# Altium schematic sheet LDO.SchDoc
size A4
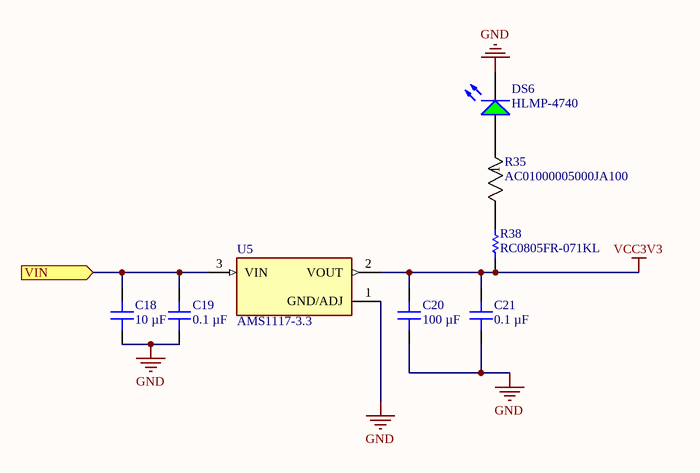
[diagram p0: LDO.SchDoc]

## Parts
C18  10 µF  [CAP 0805_2012]
C19  0.1 µF  [CAP 0805_2012]
C20  100 µF  [CAP 0805_2012]
C21  0.1 µF  [CAP 0805_2012]
DS6  HLMP-4740  [AVAG-HLMP-4740]
R35  AC01000005000JA100  [RES_AC01_VIS]
R38  RC0805FR-071KL  [RESC2013X60X35ML10T20]
U5  AMS1117-3.3  [SOT229P700X180-4N]

## Ports
VIN (in)

## Nets
GND: C18.1 C19.1 C20.1 C21.1 DS6.2(K) U5.1(GND/ADJ)
VCC3V3: C20.2 C21.2 R38.2 U5.2(VOUT)
VIN: C18.2 C19.2 U5.3(VIN) ; port VIN
NetDS6_1: DS6.1(A) R35.1
NetR35_2: R35.2 R38.1

## Library data of the parts
C18 = C2012X6S1C106K125AC: CAP CER 10UF 16V X6S 0805; manufacturer: TDK Corporation; Tolerance: ±10%; Part Number: C2012X6S1C106K125AC; Value: 10 µF; Applications: General Purpose; Capacitance: 10 µF; componentlink1description: Datasheet; componentlink1url: https://product.tdk.com/info/en/catalog/datasheets/mlcc_commercial_general_en.pdf?ref_disty=digikey; componentlink2description: DigiKey Link; componentlink2url: https://www.digikey.com/en/products/detail/tdk-corporation/C2012X6S1C106K125AC/2733046; Device Package: 0805 (2012 Metric); Features: Low ESL; lastupdated: 2023-10-02 7:13:05 PM; Lifecycle Status: Active; Minimum Order: 1; Mounting Type: Surface Mount, MLCC; Operating Temperature: -55°C ~ 105°C; Package / Case: 0805 (2012 Metric); packaging: TapeAndReel; partid: 2995; Part Status: Active; price: 0.07; series: C; Size / Dimension: 0.079" L x 0.049" W (2.00mm x 1.25mm); Supplier 1: DigiKey; Supplier Part Number 1: 445-7611-1-ND; Temperature Coefficient: X6S; Thickness (Max): 0.057" (1.45mm); Voltage - Rated: 16V
C19 C21 = CC0805MRX7R9BB104: CAP CER 0.1UF 50V X7R 0805; manufacturer: Yageo; Tolerance: ±20%; Part Number: CC0805MRX7R9BB104; Value: 0.1 µF; Applications: General Purpose; Capacitance: 0.1 µF; componentlink1description: Datasheet; componentlink1url: https://www.yageo.com/upload/media/product/productsearch/datasheet/mlcc/UPY-GPHC_X7R_6.3V-to-50V_18.pdf; componentlink2description: DigiKey Link; componentlink2url: https://www.digikey.com/en/products/detail/yageo/CC0805MRX7R9BB104/5884281; Device Package: 0805 (2012 Metric); lastupdated: 2023-10-02 7:13:07 PM; Lifecycle Status: Active; Minimum Order: 1; Mounting Type: Surface Mount, MLCC; Operating Temperature: -55°C ~ 125°C; Package / Case: 0805 (2012 Metric); packaging: TapeAndReel; partid: 2475; Part Status: Active; price: 0.01; series: CC; Size / Dimension: 0.079" L x 0.049" W (2.00mm x 1.25mm); Supplier 1: DigiKey; Supplier Part Number 1: 311-4351-1-ND; Temperature Coefficient: X7R; Thickness (Max): 0.037" (0.95mm); Voltage - Rated: 50V
C20 = PMK212BBJ107MG-T: CAP CER 100UF 2.5V X5R 0805; manufacturer: Taiyo Yuden; Tolerance: ±20%; Part Number: PMK212BBJ107MG-T; Value: 100 µF; Applications: SMPS Filtering; Capacitance: 100 µF; componentlink1description: Datasheet; componentlink1url: https://ds.yuden.co.jp/TYCOMPAS/ut/detail?pn=PMK212BBJ107MG-T  &u=M; componentlink2description: DigiKey Link; componentlink2url: https://www.digikey.com/en/products/detail/taiyo-yuden/PMK212BBJ107MG-T/4950524; Device Package: 0805 (2012 Metric); lastupdated: 2023-10-02 7:12:56 PM; Lifecycle Status: Active; Minimum Order: 1; Mounting Type: Surface Mount, MLCC; Operating Temperature: -55°C ~ 85°C; Package / Case: 0805 (2012 Metric); packaging: TapeAndReel; partid: 7580; Part Status: Active; price: 0.48; series: M; Size / Dimension: 0.079" L x 0.049" W (2.00mm x 1.25mm); Supplier 1: DigiKey; Supplier Part Number 1: 587-3978-1-ND; Temperature Coefficient: X5R; Thickness (Max): 0.053" (1.35mm); Voltage - Rated: 2.5V
DS6 = CMP-2000-06413-1: T-1 3/4 (5 mm) Low Current LED Lamp, Green, 1.9 V, -20 to 100 degC, 2-Pin THD, RoHS, Bulk; Manufacturer: AvagoTechnologies; Type: Uni-Color; Peak Wavelength: 565nm; Rad Hard: No; Viewing Angle: 50°; Dominant Wavelength/Color Temperature: 569nm; Number of LEDs: 1; Lens Appearance: ColoredDiffused; Lens Shape Type: Circular; Mounting Orientation: TopMount; Intensity: 2.3mcd; Datasheet Version: 07/2014; Category: LEDs; Datasheet URL: http://docs.avagotech.com/docs/AV02-1557EN; Packaging: Bulk; Pin Count: 2; Mounting Technology: ThroughHole; Package Reference: HLMP-4740; Mounting: ThroughHole; Manufacturer URL: http://www.avagotech.com/; Color: Green; Package: 2T-13/4; Package Description: 2-Pin Through Hole Device, Dia 5.845 mm, Pitch 2.54 mm
R35 = CMP-00030-39746512-1: AC01000005000JA100 Res Wirewound 500 Ohm 5% 1W 100ppm/°C to 180ppm/°C Conformal AXL Thru-Hole Ammo Pack; Voltage Rating (DC): 22V; Lead Diameter: 800µm; Resistance: 500Ω; Weight: 519.986953mg; Number of Pins: 2; Min Operating Temperature: -40°C; Case/Package: Axial; Schedule B: 8533210080, 8533210080; Features: Flame Retardant Coating; Power Rating: 1W; Max Power Dissipation: 1W; Packaging: Tape & Box (TB); RoHS: Compliant; REACH SVHC: Unknown; NexarPartId: 39746512; Temperature Coefficient: 180ppm/°C; Diameter: 4.3mm; Contact Plating: Tin; Radiation Hardening: No; Max Operating Temperature: 275°C; Length: 11mm; Tolerance: 5%; Composition: Wirewound; Number of Terminations: 2; Termination: Axial; Voltage Rating: 22V
R38 = CMP-2100-03671-1: Chip Resistor, 1 KOhm, +/- 1%, 125 mW, -55 to 155 degC, 0805 (2012 Metric), RoHS, Tape and Reel; Manufacturer: Yageo; Temperature Coefficient: 100ppm/degreesC; Voltage Rating (DC): 150V; Max Power Dissipation: 125mW; Resistance: 1KOhm; Number of Pins: 2; Number of Terminations: 2; Datasheet URL: http://www.yageo.com/NewPortal/yageodocoutput?fileName=/pdf/R-Chip/PYu-RC_Group_51_RoHS_L_5.pdf; Length: 0.079inch; Package Description: 2-Pin Surface Mounted Device, Body 2 x 1.25 mm; Depth: 1.25mm; Height: 0.024inch; Military Standard: Not; Case/Package: 0805; Package Reference: 0805; RoHSCompliant: true; Lead Free: LeadFree; Packaging: TapeandReel; Package Quantity: 1; Datasheet Version: Rev. 5, 10/2016; Tolerance: 1%; Min Operating Temperature: -55degC; Voltage Rating: 150V; Composition: ThickFilm; Case Code (Imperial): 0805; Power Rating: 125mW; Width: 0.049inch; Case Code (Metric): 2012; Manufacturer URL: http://www.yageo.com/; Max Operating Temperature: 155degC; REACH SVHC: Unknown; Termination: SMD/SMT
U5 = AMS1117-3.3: Sot223/Pkg 1-Amp 3.3-Volt Low Drop Out Voltage Regulatator; MF: Advanced Monolithic Systems; Package: SOT-223 Seeed Technology; Value: *; Check_prices: https://www.snapeda.com/parts/AMS1117-3.3/Advanced+Monolithic+Systems/view-part/?ref=eda; Price: None; Availability: Not in stock; MP: AMS1117-3.3; SnapEDA_Link: https://www.snapeda.com/parts/AMS1117-3.3/Advanced+Monolithic+Systems/view-part/?ref=snap